# EAGLE design Laser_Array_Temp (EAGLE 7.7.0)
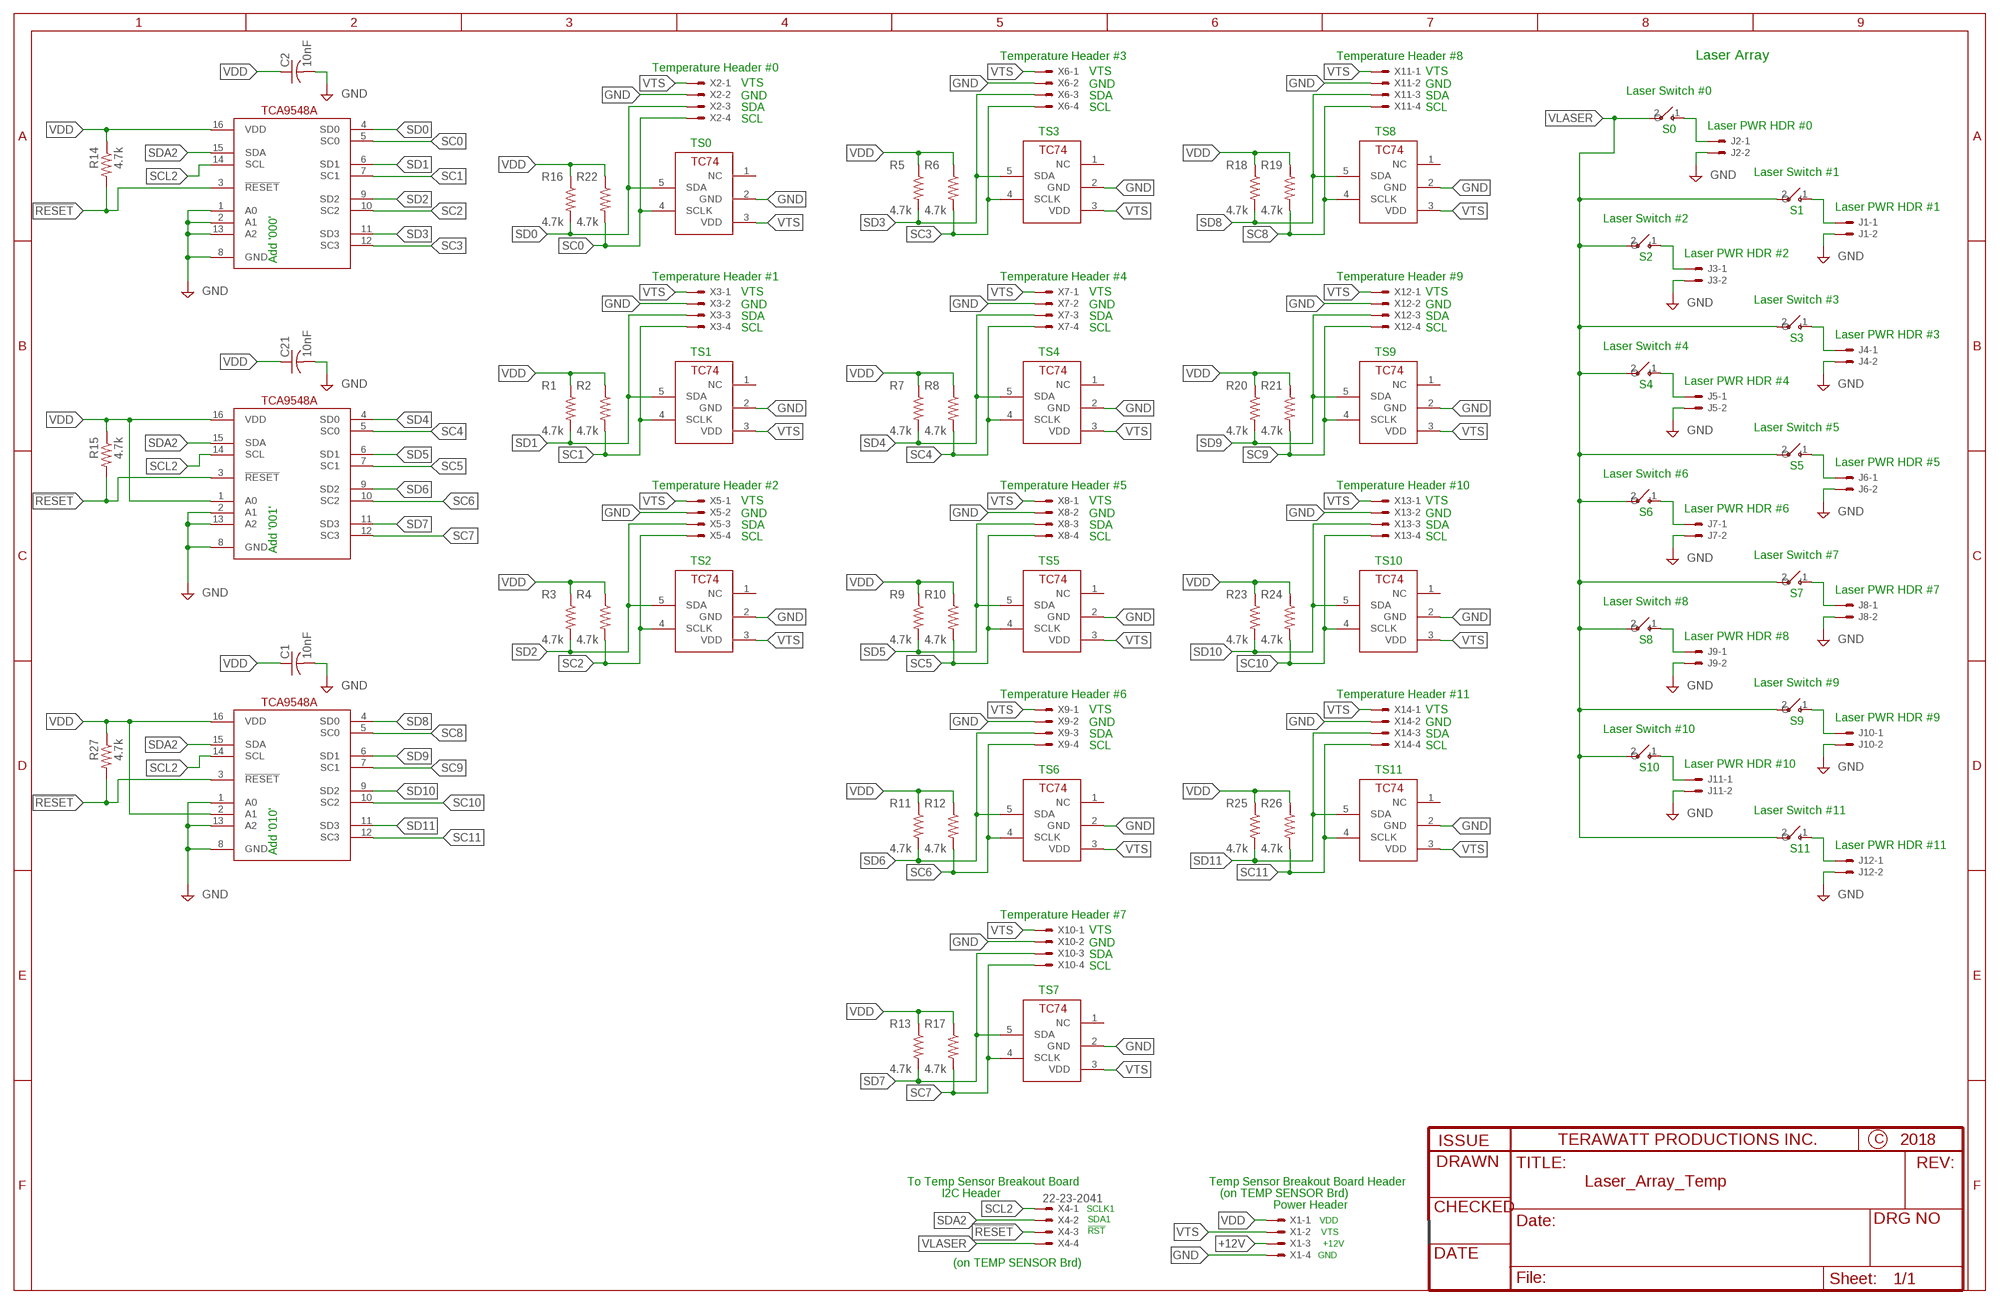
[diagram p0: schematic, sheet 1]

## Parts
C1  10nF  C-USC0805  [C0805]
C2  10nF  C-USC0805  [C0805]
C21  10nF  C-USC0805  [C0805]
J1  22-23-2021  [22-23-2021]
J2  22-23-2021  [22-23-2021]
J3  22-23-2021  [22-23-2021]
J4  22-23-2021  [22-23-2021]
J5  22-23-2021  [22-23-2021]
J6  22-23-2021  [22-23-2021]
J7  22-23-2021  [22-23-2021]
J8  22-23-2021  [22-23-2021]
J9  22-23-2021  [22-23-2021]
J10  22-23-2021  [22-23-2021]
J11  22-23-2021  [22-23-2021]
J12  22-23-2021  [22-23-2021]
R1  4.7k  R-US_M0805  [M0805]
R2  4.7k  R-US_M0805  [M0805]
R3  4.7k  R-US_M0805  [M0805]
R4  4.7k  R-US_M0805  [M0805]
R5  4.7k  R-US_M0805  [M0805]
R6  4.7k  R-US_M0805  [M0805]
R7  4.7k  R-US_M0805  [M0805]
R8  4.7k  R-US_M0805  [M0805]
R9  4.7k  R-US_M0805  [M0805]
R10  4.7k  R-US_M0805  [M0805]
R11  4.7k  R-US_M0805  [M0805]
R12  4.7k  R-US_M0805  [M0805]
R13  4.7k  R-US_M0805  [M0805]
R14  4.7k  R-US_M0805  [M0805]
R15  4.7k  R-US_M0805  [M0805]
R16  4.7k  R-US_M0805  [M0805]
R17  4.7k  R-US_M0805  [M0805]
R18  4.7k  R-US_M0805  [M0805]
R19  4.7k  R-US_M0805  [M0805]
R20  4.7k  R-US_M0805  [M0805]
R21  4.7k  R-US_M0805  [M0805]
R22  4.7k  R-US_M0805  [M0805]
R23  4.7k  R-US_M0805  [M0805]
R24  4.7k  R-US_M0805  [M0805]
R25  4.7k  R-US_M0805  [M0805]
R26  4.7k  R-US_M0805  [M0805]
R27  4.7k  R-US_M0805  [M0805]
S13  TOGGLE_SPST  [22-23-2021]
S14  TOGGLE_SPST  [22-23-2021]
S15  TOGGLE_SPST  [22-23-2021]
S16  TOGGLE_SPST  [22-23-2021]
S17  TOGGLE_SPST  [22-23-2021]
S18  TOGGLE_SPST  [22-23-2021]
S19  TOGGLE_SPST  [22-23-2021]
S20  TOGGLE_SPST  [22-23-2021]
S21  TOGGLE_SPST  [22-23-2021]
S22  TOGGLE_SPST  [22-23-2021]
S23  TOGGLE_SPST  [22-23-2021]
S24  TOGGLE_SPST  [22-23-2021]
TS1  TC74  [SOT23-5L]
TS2  TC74  [SOT23-5L]
TS3  TC74  [SOT23-5L]
TS4  TC74  [SOT23-5L]
TS5  TC74  [SOT23-5L]
TS6  TC74  [SOT23-5L]
TS7  TC74  [SOT23-5L]
TS8  TC74  [SOT23-5L]
TS9  TC74  [SOT23-5L]
TS10  TC74  [SOT23-5L]
TS11  TC74  [SOT23-5L]
TS12  TC74  [SOT23-5L]
U1  TCA9546A  [SOIC16N]
U2  TCA9546A  [SOIC16N]
U3  TCA9546A  [SOIC16N]
X1  22-23-2041  [22-23-2041]
X2  22-23-2041  [22-23-2041]
X3  22-23-2041  [22-23-2041]
X4  22-23-2041  [22-23-2041]
X5  22-23-2041  [22-23-2041]
X6  22-23-2041  [22-23-2041]
X7  22-23-2041  [22-23-2041]
X8  22-23-2041  [22-23-2041]
X9  22-23-2041  [22-23-2041]
X10  22-23-2041  [22-23-2041]
X11  22-23-2041  [22-23-2041]
X12  22-23-2041  [22-23-2041]
X13  22-23-2041  [22-23-2041]
X14  22-23-2041  [22-23-2041]

## Nets
!RESET: R14.2 R15.2 R27.2 U1.3(!RESET) U2.3(!RESET) U3.3(!RESET) X4.3
+12V: X1.3
GND: C1.2 C2.2 C21.2 J1.2 J2.2 J3.2 J4.2 J5.2 J6.2 J7.2 J8.2 J9.2 J10.2 J11.2 J12.2 TS1.2(GND) TS2.2(GND) TS3.2(GND) TS4.2(GND) TS5.2(GND) TS6.2(GND) TS7.2(GND) TS8.2(GND) TS9.2(GND) TS10.2(GND) TS11.2(GND) TS12.2(GND) U1.1(A0) U1.2(A1) U1.8(GND) U1.13(A2) U2.2(A1) U2.8(GND) U2.13(A2) U3.1(A0) U3.8(GND) U3.13(A2) X1.4 X2.2 X3.2 X5.2 X6.2 X7.2 X8.2 X9.2 X10.2 X11.2 X12.2 X13.2 X14.2
N$1: J1.1 S13.1(O)
N$2: J2.1 S16.1(O)
N$3: J3.1 S14.1(O)
N$4: J4.1 S15.1(O)
N$5: J5.1 S17.1(O)
N$6: J6.1 S18.1(O)
N$7: J7.1 S19.1(O)
N$8: J8.1 S20.1(O)
N$9: J9.1 S21.1(O)
N$10: J10.1 S22.1(O)
N$11: J11.1 S23.1(O)
N$12: J12.1 S24.1(O)
SC0: R22.2 TS1.4(SCLK) U1.5(SC0) X2.4
SC1: R2.2 TS2.4(SCLK) U1.7(SC1) X3.4
SC2: R4.2 TS3.4(SCLK) U1.10(SC2) X5.4
SC3: R6.2 TS4.4(SCLK) U1.12(SC3) X6.4
SC4: R8.2 TS5.4(SCLK) U2.5(SC0) X7.4
SC5: R10.2 TS6.4(SCLK) U2.7(SC1) X8.4
SC6: R12.2 TS7.4(SCLK) U2.10(SC2) X9.4
SC7: R17.2 TS8.4(SCLK) U2.12(SC3) X10.4
SC8: R19.2 TS9.4(SCLK) U3.5(SC0) X11.4
SC9: R21.2 TS10.4(SCLK) U3.7(SC1) X12.4
SC10: R24.2 TS11.4(SCLK) U3.10(SC2) X13.4
SC11: R26.2 TS12.4(SCLK) U3.12(SC3) X14.4
SCL2: U1.14(SCL) U2.14(SCL) U3.14(SCL) X4.1
SD0: R16.2 TS1.5(SDA) U1.4(SD0) X2.3
SD1: R1.2 TS2.5(SDA) U1.6(SD1) X3.3
SD2: R3.2 TS3.5(SDA) U1.9(SD2) X5.3
SD3: R5.2 TS4.5(SDA) U1.11(SD3) X6.3
SD4: R7.2 TS5.5(SDA) U2.4(SD0) X7.3
SD5: R9.2 TS6.5(SDA) U2.6(SD1) X8.3
SD6: R11.2 TS7.5(SDA) U2.9(SD2) X9.3
SD7: R13.2 TS8.5(SDA) U2.11(SD3) X10.3
SD8: R18.2 TS9.5(SDA) U3.4(SD0) X11.3
SD9: R20.2 TS10.5(SDA) U3.6(SD1) X12.3
SD10: R23.2 TS11.5(SDA) U3.9(SD2) X13.3
SD11: R25.2 TS12.5(SDA) U3.11(SD3) X14.3
SDA2: U1.15(SDA) U2.15(SDA) U3.15(SDA) X4.2
VDD: C1.1 C2.1 C21.1 R1.1 R2.1 R3.1 R4.1 R5.1 R6.1 R7.1 R8.1 R9.1 R10.1 R11.1 R12.1 R13.1 R14.1 R15.1 R16.1 R17.1 R18.1 R19.1 R20.1 R21.1 R22.1 R23.1 R24.1 R25.1 R26.1 R27.1 U1.16(VDD) U2.1(A0) U2.16(VDD) U3.2(A1) U3.16(VDD) X1.1
VLASER: S13.2(I) S14.2(I) S15.2(I) S16.2(I) S17.2(I) S18.2(I) S19.2(I) S20.2(I) S21.2(I) S22.2(I) S23.2(I) S24.2(I) X4.4
VTS: TS1.3(VDD) TS2.3(VDD) TS3.3(VDD) TS4.3(VDD) TS5.3(VDD) TS6.3(VDD) TS7.3(VDD) TS8.3(VDD) TS9.3(VDD) TS10.3(VDD) TS11.3(VDD) TS12.3(VDD) X1.2 X2.1 X3.1 X5.1 X6.1 X7.1 X8.1 X9.1 X10.1 X11.1 X12.1 X13.1 X14.1
Unconnected: TS1.1(NC) TS2.1(NC) TS3.1(NC) TS4.1(NC) TS5.1(NC) TS6.1(NC) TS7.1(NC) TS8.1(NC) TS9.1(NC) TS10.1(NC) TS11.1(NC) TS12.1(NC)

## Notes on the sheet
- Temperature Header #3 | Temperature Header #8 | Laser Array
- Temperature Header #0
- VTS | VTS
- VTS | GND | GND
- Laser Switch #0
- GND | SDA | SDA
- SDA | SCL | SCL
- SCL
- Laser PWR HDR #0
- TS3 | TS8 | S0
- TS0
- Laser Switch #1
- Laser PWR HDR #1
- S1
- Laser Switch #2
- Laser PWR HDR #2
- Add '000' | S2
- Temperature Header #1 | Temperature Header #4 | Temperature Header #9
- VTS | VTS | VTS
- Laser Switch #3
- GND | GND | GND
- SDA | SDA | SDA
- SCL | SCL | SCL
- Laser PWR HDR #3
- S3
- Laser Switch #4
- TS1 | TS4 | TS9
- Laser PWR HDR #4
- S4
- Laser Switch #5
- Laser PWR HDR #5
- S5
- Laser Switch #6
- Temperature Header #2 | Temperature Header #5 | Temperature Header #10
- VTS | VTS | VTS
- Laser PWR HDR #6
- GND | GND | GND | S6
- SDA | SDA | SDA
- SCL | SCL | SCL
- Add '001'
- Laser Switch #7
- TS2 | TS5 | TS10
- Laser PWR HDR #7
- S7
- Laser Switch #8
- Laser PWR HDR #8
- S8
- Laser Switch #9
- Temperature Header #6 | Temperature Header #11
- VTS | VTS
- Laser PWR HDR #9
- GND | GND | S9
- Laser Switch #10
- SDA | SDA
- SCL | SCL
- Laser PWR HDR #10
- TS6 | TS11 | S10
- Laser Switch #11
- Laser PWR HDR #11
- Add '010' | S11
- Temperature Header #7
- VTS
- GND
- SDA
- SCL
- TS7
- To Temp Sensor Breakout Board | Temp Sensor Breakout Board Header
- I2C Header | (on TEMP SENSOR Brd)
- Power Header
- SCLK1
- SDA1 | VDD
- !RST | VTS
- +12V
- GND
- (on TEMP SENSOR Brd)

## Library data of the parts
C1 C2 C21 = rcl:C-US: CAPACITOR, American symbol
J1-J12 = Mine:22-23-2021: .100" (2.54mm) Center Header - 2 Pin; MF: MOLEX; MPN: 22-23-2021; OC_FARNELL: 1462926; OC_NEWARK: 25C3832
R1-R27 = rcl:R-US_: RESISTOR, American symbol
S13-S24 = Mine:TOGGLE_SPST: SPST Toggle SPST toggle switch with no package
TS1-TS12 = Mine:TC74
U1-U3 = Mine:TCA9546A
X1-X14 = Mine:22-23-2041: .100" (2.54mm) Center Header - 4 Pin; MF: MOLEX; MPN: 22-23-2041; OC_FARNELL: 1462920; OC_NEWARK: 38C0355

## Net classes
0 default: width 0.254 mm, drill 0.508 mm, clearance 0.203 mm

## Board
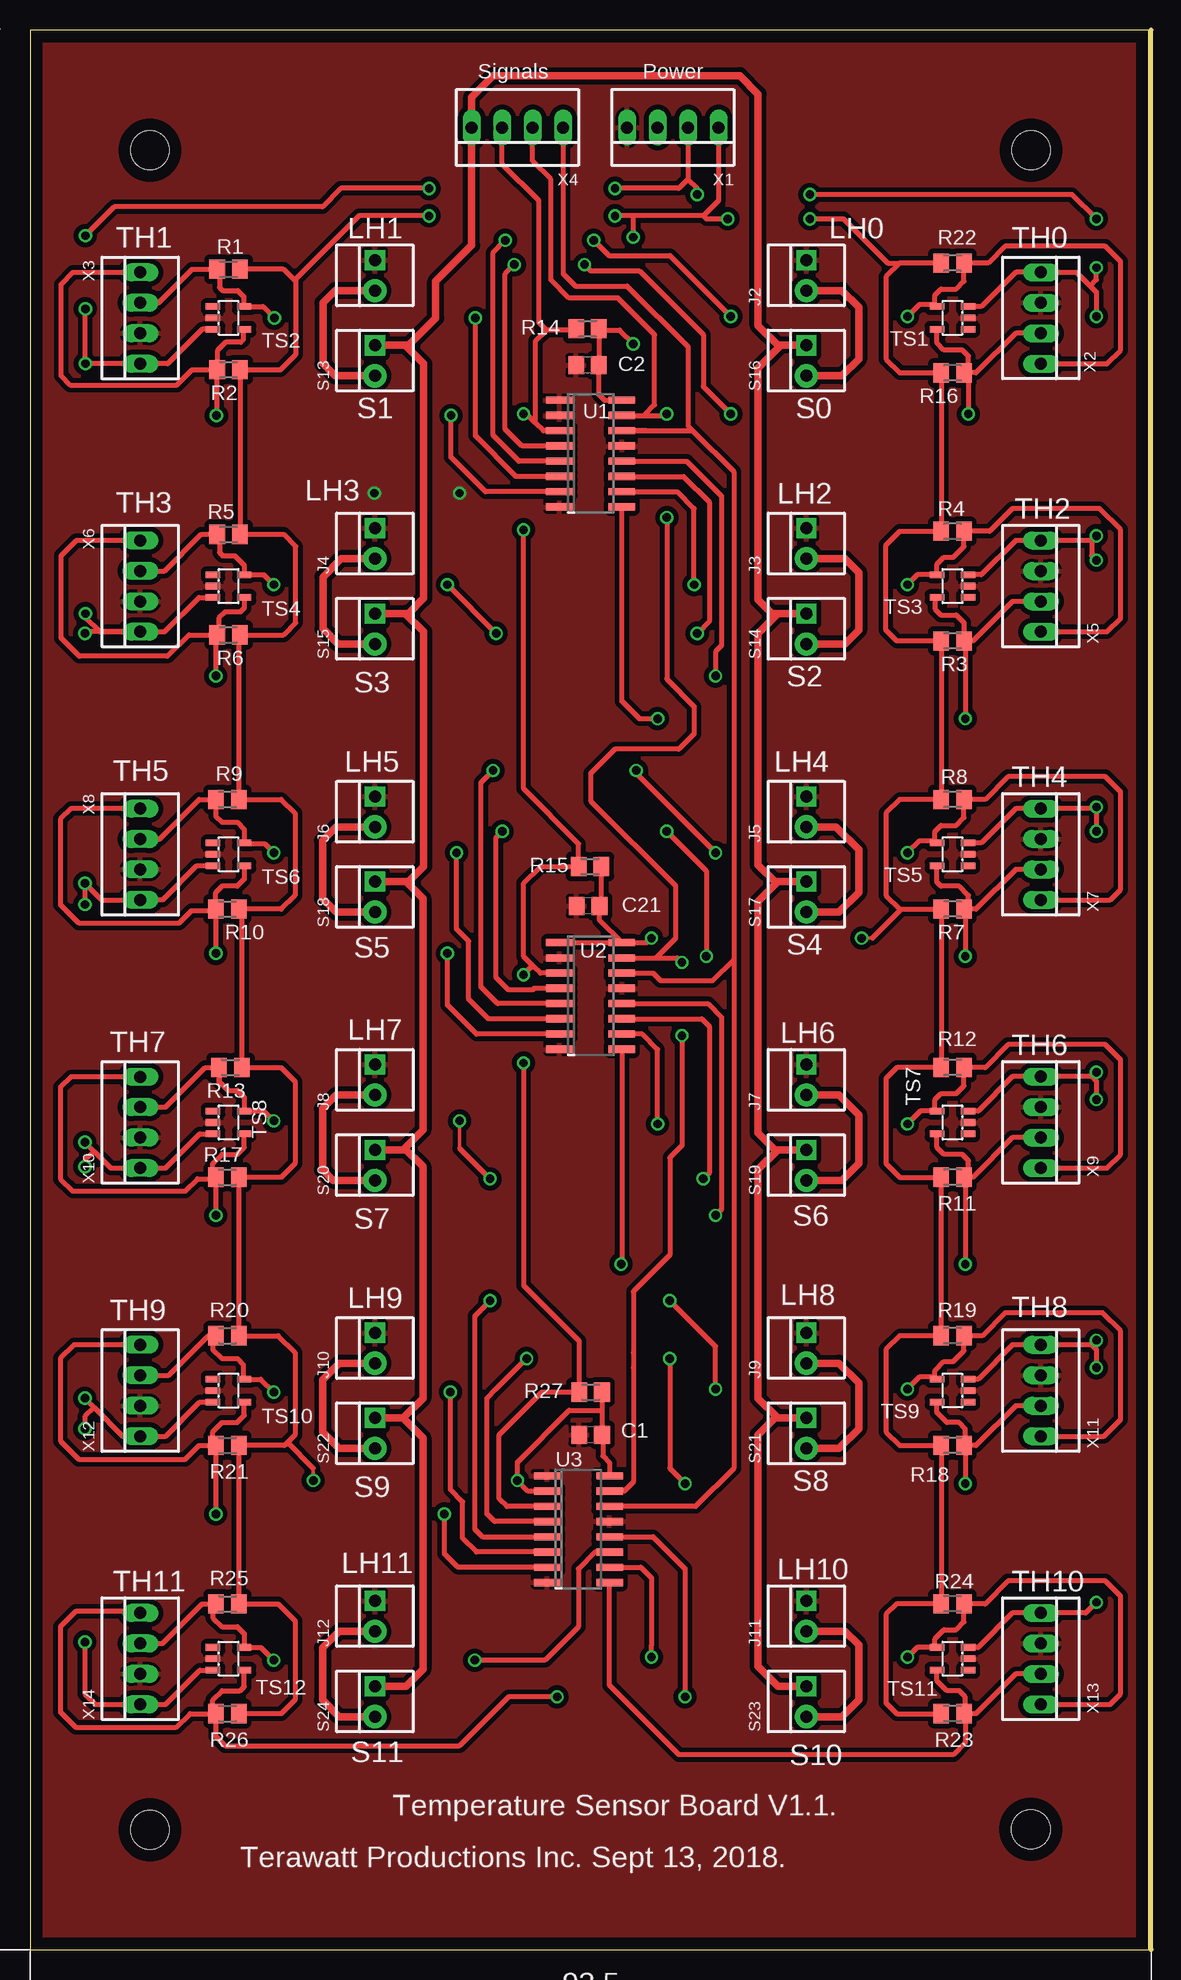
[diagram p1: board, top side]
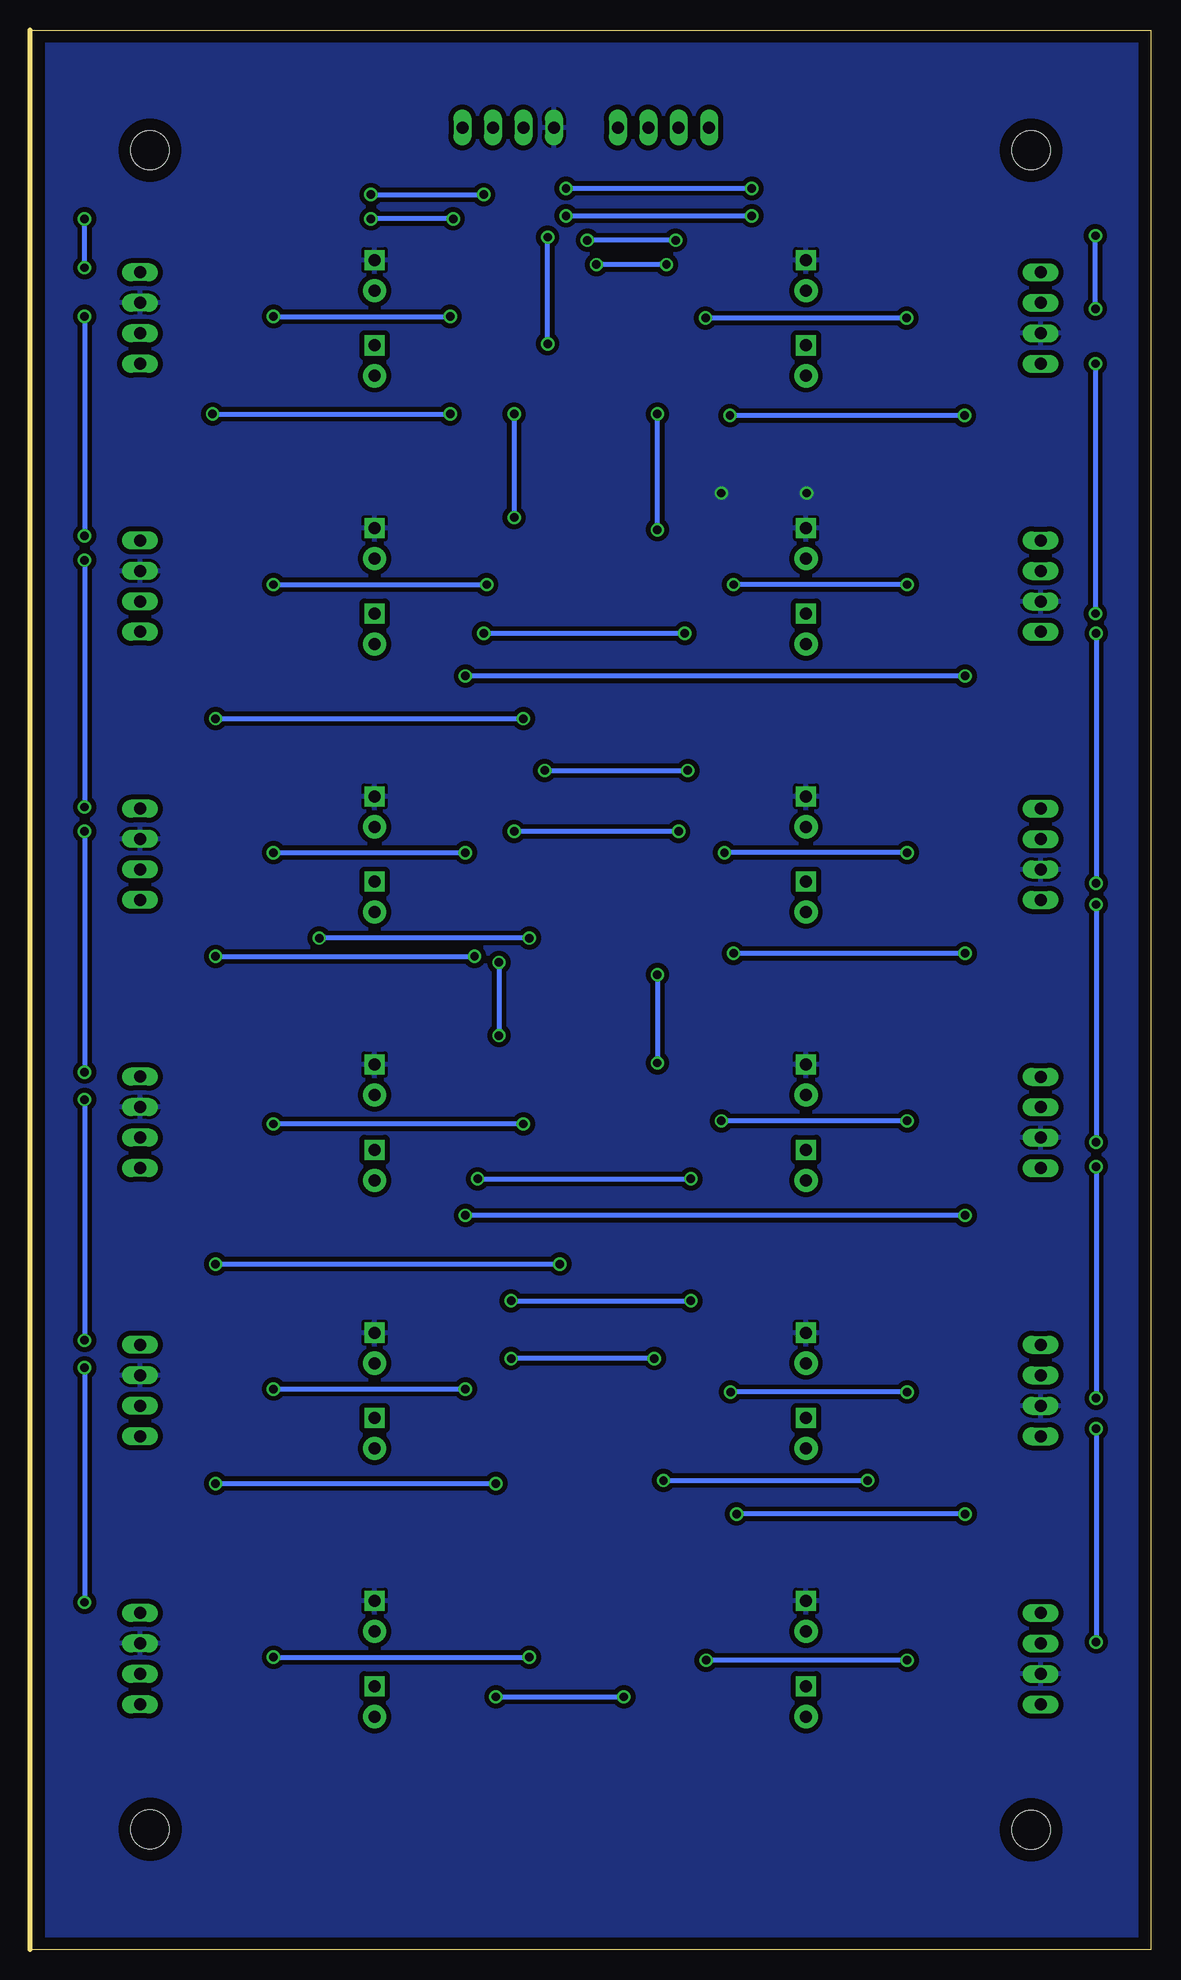
[diagram p2: board, bottom side, seen from below]

Size 93.45 x 160.02 mm. Coordinates in mm from the lower left corner, seen from the top.
Outline: 0,0 93.45,0 93.45,160.02 0,160.02 0,0
Copper layers (1*16): Top 0.035mm / dielectric 1.5mm / Bottom 0.035mm
Design rules "default *": minimum track width 10mil, minimum drill 24mil, track to track 16mil, track to pad 14mil, pad to pad 14mil, via to via 14mil, smd to smd 14mil, copper to edge 40mil, drill to drill 8mil, minimum pad ring 10mil, minimum via ring 8mil, stop-mask expansion 4mil, vias tented up to drill 0mil, thermal gap 10mil
Holes 3.2 mm at 10,10 10,150 83.44,10.04 83.46,150

### Footprints (pad centres in the part's own frame; a part is rotated, then mirrored left to right if it is on the bottom)
C0805 = smd 1.3 x 1.5: 1 -0.95,0; 2 0.95,0
22-23-2021 = drill 1 pad 1.93: 1 -1.27,0 | drill 1 pad 1.676 square: 2 1.27,0
M0805 = smd 1.3 x 1.6: 1 -0.95,0; 2 0.95,0
SOT23-5L = smd 0.55 x 1.2: 1 -0.95,-1.3; 2 0,-1.3; 3 0.95,-1.3; 4 0.95,1.3; 5 -0.95,1.3
SOIC16N = smd 0.6 x 2.2: 1 -4.445,-2.6; 2 -3.175,-2.6; 3 -1.905,-2.6; 4 -0.635,-2.6; 5 0.635,-2.6; 6 1.905,-2.6; 7 3.175,-2.6; 8 4.445,-2.6; 9 4.445,2.6; 10 3.175,2.6; 11 1.905,2.6; 12 0.635,2.6; 13 -0.635,2.6; 14 -1.905,2.6; 15 -3.175,2.6; 16 -4.445,2.6
22-23-2041 = drill 1 long: 1 -3.81,0; 2 -1.27,0; 3 1.27,0; 4 3.81,0

### Placement (x,y rotation side)
C1  46.74,42.93 180 top
C2  46.48,132.08 180 top
C21  46.53,86.99 180 top
J1  28.75,139.57 90 top
J2  64.72,139.57 90 top
J3  64.72,117.22 90 top
J4  28.75,117.22 90 top
J5  64.72,94.87 90 top
J6  28.75,94.87 90 top
J7  64.72,72.52 90 top
J8  28.75,72.52 90 top
J9  64.72,50.16 90 top
J10  28.75,50.16 90 top
J11  64.72,27.81 90 top
J12  28.75,27.81 90 top
R1  16.56,140.08 180 top
R2  16.56,131.7 180 top
R3  76.91,109.09 0 top
R4  76.91,118.24 0 top
R5  16.56,117.98 180 top
R6  16.56,109.6 180 top
R7  76.91,86.74 0 top
R8  76.91,95.89 0 top
R9  16.46,95.89 180 top
R10  16.46,86.74 180 top
R11  76.91,64.39 0 top
R12  76.91,73.53 0 top
R13  16.72,73.53 180 top
R14  46.48,135.13 180 top
R15  46.69,90.3 180 top
R16  76.91,131.44 0 top
R17  16.46,64.39 180 top
R18  76.91,42.04 0 top
R19  76.91,51.18 0 top
R20  16.46,51.18 180 top
R21  16.46,42.04 180 top
R22  76.91,140.59 0 top
R23  76.91,19.68 0 top
R24  76.91,28.83 0 top
R25  16.46,28.83 180 top
R26  16.46,19.69 180 top
R27  46.74,46.48 180 top
S13  28.75,132.46 90 top
S14  64.72,110.11 90 top
S15  28.75,110.11 90 top
S16  64.72,132.46 90 top
S17  64.72,87.76 90 top
S18  28.75,87.76 90 top
S19  64.72,65.41 90 top
S20  28.75,65.4 90 top
S21  64.72,43.05 90 top
S22  28.75,43.05 90 top
S23  64.72,20.7 90 top
S24  28.75,20.7 90 top
TS1  76.91,136.02 90 top
TS2  16.56,136.02 270 top
TS3  76.91,113.67 90 top
TS4  16.56,113.66 270 top
TS5  76.91,91.31 90 top
TS6  16.56,91.31 270 top
TS7  76.91,68.96 90 top
TS8  16.56,68.96 270 top
TS9  76.91,46.61 90 top
TS10  16.56,46.61 270 top
TS11  76.91,24.26 90 top
TS12  16.56,24.26 270 top
U1  46.74,124.71 270 top
U2  46.74,79.5 270 top
U3  45.72,35.05 270 top
X1  53.59,151.89 180 top
X2  84.28,136.02 270 top
X3  9.19,136.02 90 top
X4  40.64,151.89 180 top
X5  84.28,113.67 270 top
X6  9.19,113.66 90 top
X7  84.28,91.31 270 top
X8  9.19,91.31 90 top
X9  84.28,68.96 270 top
X10  9.19,68.96 90 top
X11  84.28,46.61 270 top
X12  9.19,46.61 90 top
X13  84.28,24.26 270 top
X14  9.19,24.26 90 top

### Tracks (layer width: path | path; a pad name or v marks a point on that pad's centre or on a via)
!RESET  (via drill 0.7)
  Top 0.406: U1.3 42.8,126.62 42.16,127.25 | 42.16,127.25 42.16,134.11 43.05,135 | R14.2 45.41,135 43.05,135 | 42.16,127.25 41.4,128.02 v41.15,128.02 | 43.05,135 42.42,135.64 42.42,145.8 39.37,148.84 X4.3 | U2.3 42.55,81.41 42.04,81.92 | 42.04,81.92 41.15,82.8 41.15,88.9 42.55,90.3 R15.2 45.74,92.18 41.15,96.77 v41.15,118.36 | v41.15,73.91 41.15,55.37 45.79,50.73 R27.2 42.67,46.48 39.12,42.93 39.12,37.59 39.75,36.96 U3.3 | v41.15,81.28 41.78,81.92 42.04,81.92
  Bottom 0.406: v41.15,118.36 v41.15,128.02 | v41.15,81.28 v41.15,73.91
GND  (via drill 0.7)
  other vias: 28.7,121.41 35.81,121.41
  pour Top: 0,160.1 93.47,159.84 93.47,-0.25 0,0
  pour Bottom: 0,160.1 94.23,159.84 94.23,-0.25 0.25,0
N$1
  Top 0.61: J1.1 25.45,138.3 24.43,137.29 24.43,132.21 25.45,131.19 S13.1
N$2
  Top 0.61: J2.1 67.69,138.3 69.09,136.91 69.09,132.59 67.69,131.19 S16.1
N$3
  Top 0.61: J3.1 67.94,115.95 69.09,114.81 69.09,109.98 67.94,108.84 S14.1
N$4
  Top 0.61: J4.1 25.96,115.95 24.43,114.43 24.43,110.11 25.7,108.84 S15.1
N$5
  Top 0.61: J5.1 67.18,93.6 69.09,91.69 69.09,88.14 67.44,86.49 S17.1
N$6
  Top 0.61: J6.1 25.53,93.6 24.38,92.46 24.38,87.63 25.53,86.49 S18.1
N$7
  Top 0.61: J7.1 67.44,71.25 69.09,69.6 69.09,65.53 67.69,64.14 S19.1
N$8
  Top 0.61: J8.1 25.53,71.25 24.38,70.1 24.38,65.02 25.27,64.13 S20.1
N$9
  Top 0.61: J9.1 67.44,48.9 69.09,47.24 69.09,43.43 67.44,41.78 S21.1
N$10
  Top 0.61: J10.1 25.78,48.89 24.38,47.5 24.38,43.18 25.78,41.78 S22.1
N$11
  Top 0.61: J11.1 67.94,26.54 69.09,25.4 69.09,20.83 67.69,19.43 S23.1
N$12
  Top 0.61: J12.1 25.78,26.54 24.38,25.15 24.38,20.83 25.78,19.43 S24.1
SC0  (via drill 0.7)
  Top 0.406: TS1.4 75.44,137.14 | 75.44,137.14 75.44,137.92 75.95,138.43 77.22,138.43 77.86,139.07 R22.2 79.88,140.59 81.28,141.99 89.66,141.99 90.93,140.72 90.93,133.35 89.79,132.21 X2.4 | 75.44,137.14 74.15,137.14 v73.15,136.14 | U1.5 40.77,124.08 38.61,126.24 38.61,141.48 v39.62,142.49 | v58.42,136.14 53.34,141.22 48.26,141.22 v46.99,142.49
  Bottom 0.406: v73.15,136.14 v58.42,136.14 | v39.62,142.49 v46.99,142.49
SC1  (via drill 0.7)
  Top 0.406: TS2.4 17.76,134.97 17.76,134.17 17.57,133.98 16.3,133.98 15.61,133.29 R2.2 | R2.2 15.8,131.76 15.54,131.51 v15.54,127.89 | X3.4 3.6,139.83 2.59,138.81 2.59,131.19 3.35,130.43 12.24,130.43 13.51,131.7 R2.2 | U1.7 37.97,121.54 35.1,124.41 v35.1,127.89
  Bottom 0.406: v15.54,127.89 v35.1,127.89
SC2  (via drill 0.7)
  Top 0.406: X5.4 89.79,109.86 90.93,111 90.93,118.36 89.15,120.14 81.92,120.14 80.01,118.24 R4.2 77.86,116.98 76.96,116.08 76.2,116.08 75.61,115.49 TS3.4 73.97,114.61 v73.15,113.79 | U1.10 53.98,121.54 55.37,120.14 v55.37,113.79
  Bottom 0.406: v73.15,113.79 v55.37,113.79
SC3  (via drill 0.7)
  Top 0.406: X6.4 3.86,117.47 2.59,116.2 2.59,109.35 4.11,107.82 11.48,107.82 13.26,109.6 R6.2 15.75,109.74 | 15.75,109.74 15.75,111 16.26,111.51 17.53,111.51 17.86,111.84 TS4.4 | 15.75,109.74 15.75,109.22 15.49,108.97 v15.49,106.17 | U1.12 54.74,124.08 57.66,121.16 57.66,108.71 57.15,108.2 v57.15,106.17
  Bottom 0.406: v15.49,106.17 v57.15,106.17
SC4  (via drill 0.7)
  Top 0.406: TS5.4 75.44,92.44 | 75.44,92.44 75.44,93.22 75.95,93.73 77.22,93.73 77.86,94.37 R8.2 79.63,95.89 81.53,97.79 89.66,97.79 90.93,96.52 90.93,88.39 90.04,87.5 X7.4 | 75.44,92.44 74.15,92.44 v73.15,91.44 | U2.5 38.99,78.87 37.59,80.26 37.59,97.28 v38.61,98.3 | v57.15,91.44 50.55,98.04 v50.55,98.3
  Bottom 0.406: v73.15,91.44 v57.15,91.44 | v50.55,98.3 v38.61,98.3
SC5  (via drill 0.7)
  Top 0.406: X8.4 3.43,95.12 2.54,94.23 2.54,87.12 4.06,85.6 12.45,85.6 13.46,86.61 15.38,86.61 R10.2 15.49,86.76 | 15.49,86.76 15.49,88.14 16,88.65 17.27,88.65 17.86,89.23 TS6.4 | 15.49,86.76 v15.49,83.06 | U2.7 37.21,76.33 34.8,78.74 v34.8,83.06
  Bottom 0.406: v15.49,83.06 v34.8,83.06
SC6  (via drill 0.7)
  Top 0.406: X9.4 89.79,65.15 90.93,66.29 90.93,74.17 89.66,75.44 81.53,75.44 79.63,73.53 R12.2 77.86,72.02 77.22,71.37 75.95,71.37 75.44,70.87 75.44,70.08 TS7.4 74.23,69.91 v73.15,68.83 | U2.10 51.05,76.33 52.32,75.06 v52.32,68.83
  Bottom 0.406: v52.32,68.83 v73.15,68.83
SC7  (via drill 0.7)
  Top 0.406: X10.4 3.43,72.77 2.54,71.88 2.54,64.26 3.56,63.25 12.95,63.25 13.97,64.26 15.38,64.26 R17.2 | R17.2 15.24,64.66 15.24,65.53 16,66.29 17.27,66.29 17.86,66.88 TS8.4 | R17.2 15.49,64.37 v15.49,61.21 | U2.12 56.52,78.87 57.66,77.72 57.66,61.72 v57.15,61.21
  Bottom 0.406: v15.49,61.21 v57.15,61.21
SC8  (via drill 0.7)
  Top 0.406: TS9.4 75.44,47.73 | 75.44,47.73 75.44,48.26 76.2,49.02 76.96,49.02 77.86,49.92 R19.2 79.38,51.18 81.28,53.09 89.41,53.09 90.93,51.56 90.93,44.2 89.53,42.8 X11.4 | 75.44,47.73 74.15,47.73 v73.15,46.74 | v57.15,46.74 57.15,50.29 v53.34,54.1 | v38.35,54.1 37.97,53.72 37.59,53.34 37.08,52.83 37.08,35.05 37.72,34.42 U3.5
  Bottom 0.406: v73.15,46.74 v57.15,46.74 | v53.34,54.1 v38.35,54.1
SC9  (via drill 0.7)
  Top 0.406: X12.4 3.68,50.42 2.54,49.28 2.54,42.42 4.06,40.89 12.95,40.89 14.1,42.04 R21.2 | R21.2 15.24,42.31 15.24,43.18 16,43.94 17.27,43.94 17.86,44.53 TS10.4 | R21.2 15.49,42.02 v15.49,36.32 | U3.7 35.69,31.88 34.54,33.02 v34.54,36.32
  Bottom 0.406: v15.49,36.32 v34.54,36.32
SC10  (via drill 0.7)
  Top 0.406: X13.4 90.04,20.45 90.93,21.34 90.93,29.46 89.66,30.73 81.53,30.73 79.63,28.83 R24.2 77.86,27.32 77.22,26.67 76.2,26.67 75.44,25.91 75.44,25.38 TS11.4 73.97,25.21 v73.15,24.38 | U3.10 50.93,31.88 51.82,30.99 51.82,25.4 v51.82,24.38
  Bottom 0.406: v73.15,24.38 v51.82,24.38
SC11  (via drill 0.7)
  Top 0.406: X14.4 9.06,28.19 3.81,28.19 2.54,26.92 2.54,19.81 3.81,18.54 12.19,18.54 13.34,19.69 R26.2 | R26.2 15.24,19.96 15.24,20.83 16,21.59 17.53,21.59 17.86,21.92 TS12.4 | R26.2 15.49,19.67 15.49,17.78 16.26,17.02 35.81,17.02 39.88,21.08 v43.94,21.08 | U3.12 51.94,34.42 54.61,31.75 v54.61,21.08
  Bottom 0.406: v54.61,21.08 v43.94,21.08
SCL2
  Top 0.406: X4.1 44.45,139.7 45.47,138.68 49.78,138.68 54.86,133.6 54.86,127 55.24,126.62 | 51.44,126.62 U1.14 55.24,126.62 | 55.24,126.62 58.67,123.19 58.67,82.55 | U2.14 51.94,81.41 52.58,80.77 56.9,80.77 58.67,82.55 | 58.67,82.55 58.67,40.13 55.5,36.96 U3.14
SD0  (via drill 0.7)
  Top 0.406: R16.2 78.23,131.82 78.23,132.84 77.72,133.35 76.2,133.35 75.61,133.94 TS1.5 | X2.3 82.17,134.75 78.87,131.44 R16.2 | R16.2 78.23,131.07 v78.23,128.02 | U1.4 41.02,125.35 39.62,126.75 39.62,139.7 v40.39,140.46 | v58.42,128.02 56.13,130.3 56.13,134.62 50.8,139.95 46.74,139.95 v46.23,140.46
  Bottom 0.406: v78.23,128.02 v58.42,128.02 | v40.39,140.46 v46.23,140.46
SD1  (via drill 0.7)
  Top 0.406: X3.3 10.72,137.29 13.51,140.08 R1.2 15.8,139.89 15.8,138.56 16.05,138.3 17.32,138.3 17.83,137.79 17.83,137 TS2.5 19.42,136.97 v20.37,136.02 | U1.6 40.51,122.81 37.13,126.19 v37.13,136.02
  Bottom 0.406: v20.37,136.02 v37.13,136.02
SD2  (via drill 0.7)
  Top 0.406: X5.3 81.92,112.39 78.61,109.09 R3.2 | TS3.5 75.44,112.54 75.44,111.76 75.95,111.25 77.22,111.25 77.86,110.61 R3.2 | R3.2 77.98,108.98 v77.98,102.62 | U1.9 49.34,104.08 50.8,102.62 v52.32,102.62
  Bottom 0.406: v77.98,102.62 v52.32,102.62
SD3  (via drill 0.7)
  Top 0.406: X6.3 11.22,114.93 14.27,117.98 R5.2 16.05,117.66 15.8,117.41 15.8,116.46 16.05,116.2 17.07,116.2 17.86,115.41 TS4.5 19.5,114.61 v20.32,113.79 | U1.11 54.48,122.81 56.64,120.65 56.64,110.74 v55.63,109.73 | v34.8,113.79 v38.86,109.73
  Bottom 0.406: v20.32,113.79 v34.8,113.79 | v38.86,109.73 v55.63,109.73
SD4  (via drill 0.7)
  Top 0.406: X7.3 82.17,90.04 78.87,86.74 R7.2 | R7.2 78.23,87.11 78.23,87.88 77.47,88.65 75.95,88.65 75.61,88.98 TS5.5 | R7.2 77.98,86.62 v77.98,82.8 | U2.4 42.04,80.14 41.91,80.01 39.88,80.01 38.86,81.03 38.86,92.71 v39.37,93.22 | v53.09,93.22 56.39,89.92 v56.39,82.8
  Bottom 0.406: v77.98,82.8 v56.39,82.8 | v39.37,93.22 v53.09,93.22
SD5  (via drill 0.7)
  Top 0.406: X8.3 10.79,92.58 14.1,95.89 R9.2 15.49,95.87 15.49,94.49 16,93.98 17.27,93.98 17.86,93.39 17.86,92.28 | 17.86,92.28 TS6.5 | 17.86,92.28 17.78,92.2 19.56,92.2 v20.32,91.44 | U2.6 38.23,77.6 36.58,79.25 36.58,84.07 35.56,85.09 v35.56,91.44
  Bottom 0.406: v20.32,91.44 v35.56,91.44
SD6  (via drill 0.7)
  Top 0.406: R11.2 78.23,64.76 78.23,65.79 77.72,66.29 76.2,66.29 75.61,66.88 TS7.5 | X9.3 81.92,67.69 78.61,64.39 R11.2 | R11.2 77.98,64.27 v77.98,57.15 | U2.9 49.34,57.21 v49.28,57.15
  Bottom 0.406: v77.98,57.15 v49.28,57.15
SD7  (via drill 0.7)
  Top 0.305: 35.81,66.8 v35.81,69.09
  Top 0.406: X10.3 11.3,70.23 14.61,73.53 R13.2 | R13.2 15.75,73.52 15.75,72.39 15.77,72.37 | R13.2 15.77,72.37 | 15.77,72.37 16.51,71.63 17.27,71.63 17.86,71.04 TS8.5 19.5,69.91 v20.32,69.09 | v38.35,64.26 35.81,66.8 | U2.11 56.01,77.6 56.64,76.96 56.64,64.77 v56.13,64.26
  Bottom 0.406: v20.32,69.09 v35.81,69.09 | v56.13,64.26 v38.35,64.26
SD8  (via drill 0.7)
  Top 0.406: R18.2 77.98,42.15 77.98,43.43 77.47,43.94 76.45,43.94 75.61,44.78 TS9.5 | X11.3 82.17,45.34 78.87,42.04 R18.2 | R18.2 77.98,41.92 v77.98,38.86 | U3.4 38.73,35.69 38.1,36.32 38.1,45.97 38.86,46.74 39.62,47.5 v41.4,49.28 | v53.34,49.28 53.34,40.13 v54.61,38.86
  Bottom 0.406: v77.98,38.86 v54.61,38.86 | v41.4,49.28 v53.34,49.28
SD9  (via drill 0.7)
  Top 0.406: X12.3 11.56,47.88 14.86,51.18 R20.2 15.24,50.91 15.24,50.04 16,49.28 17.27,49.28 17.78,48.77 17.78,47.64 TS10.5 19.24,47.56 v20.32,46.48 | U3.6 37.21,33.15 36.07,34.29 36.07,37.34 35.05,38.35 v35.05,46.48
  Bottom 0.406: v20.32,46.48 v35.05,46.48
SD10
  Top 0.406: R23.2 77.98,19.8 77.98,21.08 77.47,21.59 76.45,21.59 75.61,22.43 TS11.5 | X13.3 82.17,22.99 78.87,19.68 R23.2 | R23.2 77.98,19.57 77.98,17.27 76.96,16.26 54.1,16.26 48.32,22.04 U3.9
SD11  (via drill 0.7)
  Top 0.406: X14.3 11.05,25.53 14.35,28.83 R25.2 15.24,28.56 15.24,27.69 16,26.92 17.27,26.92 17.86,26.34 TS12.5 19.24,25.21 v20.32,24.13 | U3.11 47.12,33.15 45.72,31.75 45.72,26.92 42.93,24.13 v37.08,24.13
  Bottom 0.406: v20.32,24.13 v37.08,24.13
SDA2  (via drill 0.7)
  Top 0.406: X4.2 41.91,149.1 43.43,147.57 43.43,139.19 44.96,137.67 49.02,137.67 52.07,134.62 52.07,128.78 51.18,127.89 U1.15 52.96,127.89 v53.09,128.02 | U3.15 49.53,38.23 50.29,38.99 50.29,48.51 50.29,49.78 50.29,54.86 53.34,57.91 53.34,66.04 54.36,67.06 v54.36,76.2 | v53.09,119.38 53.09,105.92 55.37,103.63 55.37,101.35 54.1,100.08 48.77,100.08 46.74,98.04 46.74,95.76 53.85,88.65 53.85,84.33 52.2,82.68 U2.15 53.98,82.68 v54.36,82.3
  Bottom 0.406: v53.09,128.02 v53.09,119.38 | v54.36,82.3 v54.36,76.2
VDD  (via drill 0.7)
  Top 0.305: v69.34,84.33 70.23,84.33 | v23.62,39.12 23.62,40.13
  Top 0.406: 17.83,131.7 R2.1 | 17.83,131.7 18.02,131.51 17.51,131 R5.1 21.13,117.98 22.15,116.97 22.15,110.62 21.13,109.6 R6.1 17.41,109.5 R9.1 20.95,95.89 22.1,94.74 22.1,87.88 20.96,86.74 R10.1 17.67,86.49 R13.1 20.95,73.53 22.1,72.39 22.1,65.53 20.96,64.39 R17.1 R20.1 20.7,51.18 22.1,49.78 22.1,42.93 21.46,42.29 | 22.06,139.15 22.15,139.06 22.15,132.97 20.88,131.7 17.83,131.7 | 22.06,139.15 21.13,140.08 R1.1 | U1.16 47.88,129.16 47.43,129.61 C2.1 R14.1 47.56,135 49.15,135 v50.29,133.86 | 50.29,144.53 v48.77,144.53 | v33.27,144.53 27.43,144.53 22.06,139.15 | v50.29,142.75 50.29,144.53 | 21.46,42.29 21.21,42.04 R21.1 R25.1 20.7,28.83 22.1,27.43 22.1,20.83 20.96,19.69 R26.1 | R22.1 72.52,140.59 | 72.52,140.59 71.37,139.45 71.37,132.59 72.52,131.44 R16.1 R4.1 72.52,118.24 71.37,117.09 71.37,109.98 72.26,109.09 R3.1 R8.1 72.52,95.89 71.37,94.74 71.37,87.88 72.52,86.74 72.64,86.74 | 72.64,86.74 R7.1 R12.1 72.26,73.53 71.37,72.64 71.37,65.53 72.52,64.39 R11.1 75.95,64.37 75.95,51.56 75.96,51.55 R19.1 72.52,51.18 71.37,50.04 71.37,43.18 72.52,42.04 R18.1 R24.1 72.26,28.83 71.37,27.94 71.37,20.57 72.26,19.68 R23.1 | 56.13,144.53 50.29,144.53 | X1.1 57.4,145.8 56.13,144.53 | 56.13,144.53 56.39,144.27 v58.17,144.27 | v65.02,144.27 67.82,144.27 71.5,140.59 72.52,140.59 | U2.1 U2.16 | U2.16 47.48,85.8 C21.1 47.64,87.15 R15.1 | R27.1 47.69,44.96 | 47.69,44.96 C1.1 47.75,42.86 47.75,41.15 48.32,40.58 U3.16 | 70.23,84.33 72.64,86.74 | U3.2 41.53,38.23 v40.64,39.12 40.64,40.64 44.96,44.96 47.69,44.96 | 23.62,40.13 21.46,42.29 | U2.16 51.44,83.95 v51.82,84.33
  Bottom 0.406: v48.77,144.53 v33.27,144.53 | v50.29,133.86 v50.29,142.75 | v58.17,144.27 v65.02,144.27 | v51.82,84.33 v69.34,84.33 | v40.64,39.12 v23.62,39.12
VLASER
  Top 0.61: 31.29,111.38 31.54,111.38 32.81,112.65 32.81,132.21 31.29,133.73 S13.2 31.54,133.73 33.83,136.02 33.83,139.06 36.83,142.06 X4.4 36.83,154.43 38.61,156.21 59.18,156.21 60.71,154.69 60.71,135.38 62.36,133.73 S16.2 62.61,133.73 60.71,131.83 60.71,112.52 61.85,111.38 S14.2 62.36,111.38 60.71,109.73 60.71,90.42 62.1,89.03 S17.2 62.36,89.03 60.71,87.38 60.71,68.07 62.1,66.67 S19.2 62.36,66.67 60.71,65.02 60.71,45.97 62.36,44.32 S21.2 62.1,44.32 60.71,42.93 60.71,23.62 62.36,21.97 S23.2 | S15.2 31.29,111.38 | 31.29,111.38 32.81,109.85 32.81,90.3 31.54,89.03 S18.2 31.37,89.03 32.77,87.63 32.77,68.33 31.24,66.8 | 31.24,66.8 31.11,66.67 S20.2 | 31.24,66.8 32.77,65.28 32.77,45.97 31.11,44.32 | 31.11,44.32 S22.2 | 31.11,44.32 32.77,42.67 32.77,23.37 31.37,21.97 S24.2
VTS  (via drill 0.7)
  Top 0.406: X6.1 11.22,109.85 14.08,112.71 TS4.3 | 5.89,109.85 X6.1 | TS2.3 14.34,135.07 11.48,132.21 X3.1 v4.62,132.21 v4.62,136.78 | v4.62,142.87 7.03,145.29 24.38,145.29 25.91,146.81 v33.27,146.81 | X6.1 5.84,109.85 | 5.84,109.85 4.7,109.85 v4.57,109.73 | v4.62,111.38 4.62,111.08 5.84,109.85 | TS6.3 13.91,90.36 11.05,87.5 X8.1 5.97,87.5 v4.57,88.9 v4.57,87.12 | v4.57,67.31 5.33,66.55 | 5.33,66.55 6.73,65.15 X10.1 11.3,65.15 14.16,68.01 TS8.3 | X1.2 54.86,147.57 | 54.86,147.57 54.1,146.81 v48.77,146.81 | 5.33,66.55 4.57,65.79 v4.57,65.28 | v4.57,45.97 5.33,45.21 | 5.33,45.21 7.75,42.8 X12.1 11.3,42.8 14.16,45.66 TS10.3 | 5.33,45.21 4.57,44.45 v4.57,43.43 | v4.57,25.65 4.57,21.34 5.46,20.45 X14.1 11.3,20.45 14.16,23.31 TS12.3 | TS1.3 79.31,136.97 82.17,139.83 X2.1 87.25,139.83 88.39,138.68 | 88.39,138.68 88.9,138.18 v88.9,136.14 | 88.52,117.47 X5.1 82.17,117.47 79.31,114.61 TS3.3 | 88.52,117.47 v88.9,117.86 | 88.52,117.47 88.52,116.2 v88.9,115.82 | TS5.3 79.31,92.26 82.17,95.12 X7.1 88.77,95.12 | v88.9,95.25 88.77,95.12 | 88.77,95.12 88.9,95 v88.9,93.22 | v88.9,73.15 88.52,72.77 | 88.52,72.77 X9.1 81.92,72.77 79.06,69.91 TS7.3 | 88.52,72.77 88.9,72.39 v88.9,70.87 | v88.9,50.8 88.52,50.42 | 88.52,50.42 X11.1 81.92,50.42 79.06,47.56 TS9.3 | 88.52,50.42 88.9,50.04 v88.9,48.51 | v88.9,28.96 88.01,28.07 X13.1 81.92,28.07 79.06,25.21 TS11.3 | 54.86,147.57 55.63,146.81 v55.63,146.3 | 88.39,138.68 88.9,139.19 v88.9,140.21 | v88.9,144.27 86.87,146.3 v65.02,146.3
  Bottom 0.406: v4.62,132.21 v4.62,111.38 | v4.62,136.78 v4.62,142.87 | v4.57,109.73 v4.57,88.9 | v4.57,87.12 v4.57,67.31 | v48.77,146.81 v33.27,146.81 | v4.57,65.28 v4.57,45.97 | v4.57,43.43 v4.57,25.65 | v88.9,136.14 v88.9,117.86 | v88.9,115.82 v88.9,95.25 | v88.9,93.22 v88.9,73.15 | v88.9,70.87 v88.9,50.8 | v88.9,48.51 v88.9,28.96 | v88.9,140.21 v88.9,144.27 | v65.02,146.3 v55.63,146.3

### Text on the board
tPlace: Signals | Power | LH1 | LH0 | TH1 | TH0 | S1 | S0 | LH3 | LH2 | TH3 | TH2 | S3 | S2 | LH5 | LH4 | TH5 | TH4 | S5 | S4 | LH7 | LH6 | TH7 | TH6 | S7 | S6 | LH8 | LH9 | TH8 | TH9 | S9 | S8 | LH11 | LH10 | TH11 | TH10 | S11 | S10 | Temperature Sensor Board V1.1. | Terawatt Productions Inc. Sept 13, 2018.